# EAGLE design S3E_Cocoon (EAGLE 5.04)
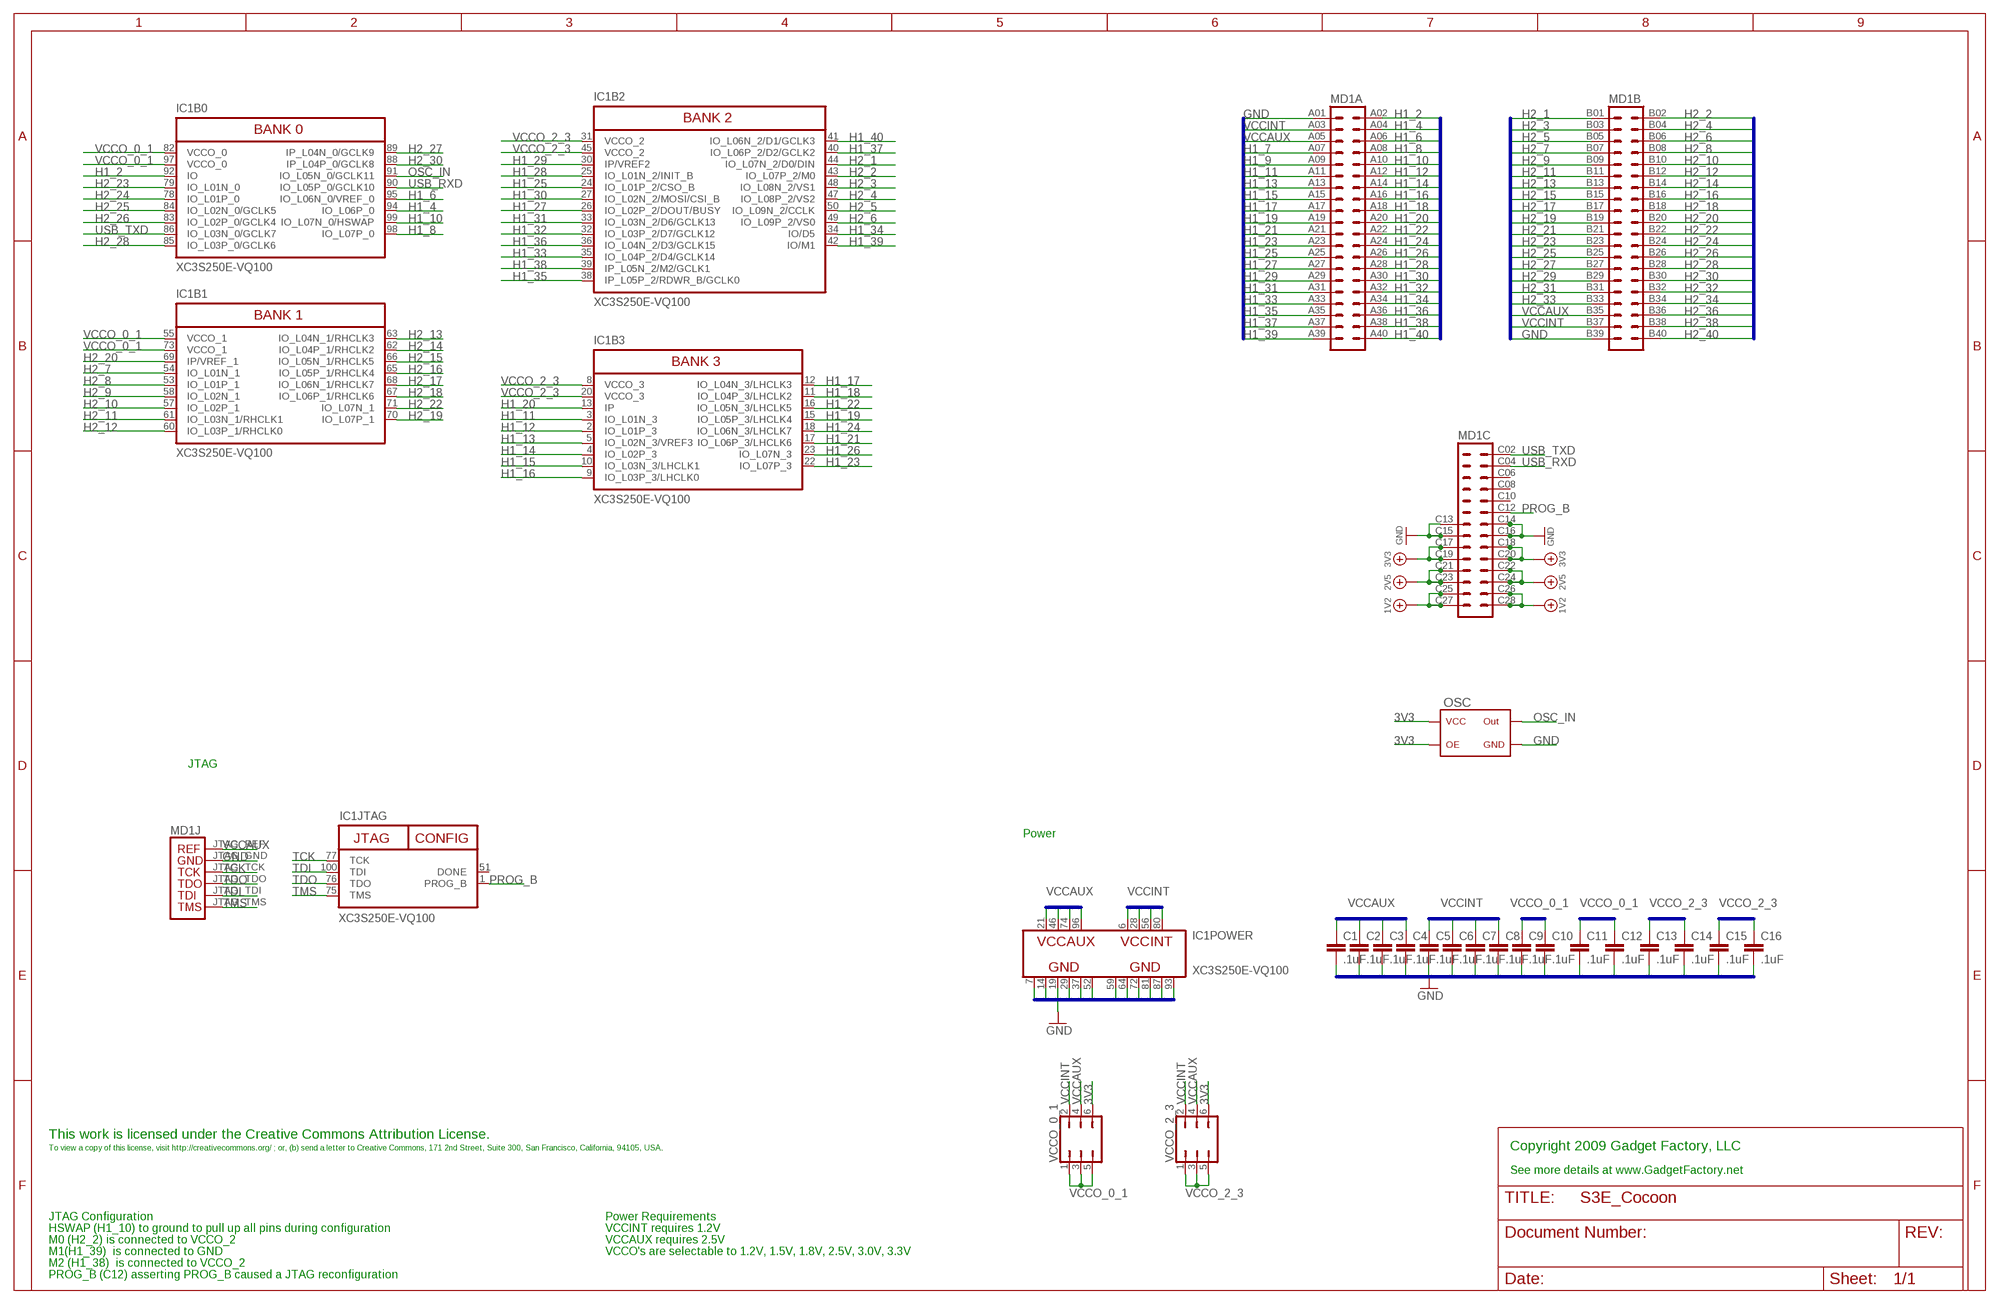
[diagram p0: schematic, sheet 1]

## Parts
C1  .1uF  C-EUC0402  [C0402]
C2  .1uF  C-EUC0402  [C0402]
C3  .1uF  C-EUC0402  [C0402]
C4  .1uF  C-EUC0402  [C0402]
C5  .1uF  C-EUC0402  [C0402]
C6  .1uF  C-EUC0402  [C0402]
C7  .1uF  C-EUC0402  [C0402]
C8  .1uF  C-EUC0402  [C0402]
C9  .1uF  C-EUC0402  [C0402]
C10  .1uF  C-EUC0402  [C0402]
C11  .1uF  C-EUC0402  [C0402]
C12  .1uF  C-EUC0402  [C0402]
C13  .1uF  C-EUC0402  [C0402]
C14  .1uF  C-EUC0402  [C0402]
C15  .1uF  C-EUC0402  [C0402]
C16  .1uF  C-EUC0402  [C0402]
IC1  XC3S250E-VQ100  [VQ100]
MD1  GADGETFACTORY_STACK  [GADGETFACTORY_STACK]
OSC  OSC1  [OSC1]
VCCO_0_1  JP3Q  [JP3Q]
VCCO_2_3  JP3Q  [JP3Q]

## Nets
3V3: MD1.C17(C:C17) MD1.C18(C:C18) MD1.C19(C:C19) MD1.C20(C:C20) OSC.1@1(OE) OSC.4@4(VCC) VCCO_0_1.6 VCCO_2_3.6
GND: C1.2 C2.2 C3.2 C4.2 C5.2 C6.2 C7.2 C8.2 C9.2 C10.2 C11.2 C12.2 C13.2 C14.2 C15.2 C16.2 IC1.7(POWER:GND) IC1.14(POWER:GND) IC1.19(POWER:GND) IC1.29(POWER:GND) IC1.37(POWER:GND) IC1.52(POWER:GND) IC1.59(POWER:GND) IC1.64(POWER:GND) IC1.72(POWER:GND) IC1.81(POWER:GND) IC1.87(POWER:GND) IC1.93(POWER:GND) MD1.A01(A:A01) MD1.B39(B:B39) MD1.C13(C:C13) MD1.C14(C:C14) MD1.C15(C:C15) MD1.C16(C:C16) MD1.JTAG_GND(J:JTAG_GND) OSC.2@2(GND)
H1_2: IC1.92(B0:IO) MD1.A02(A:A02)
H1_4: IC1.94(B0:IO_L06P_0) MD1.A04(A:A04)
H1_6: IC1.95(B0:IO_L06N_0/VREF_0) MD1.A06(A:A06)
H1_7: MD1.A07(A:A07)
H1_8: IC1.98(B0:IO_L07P_0) MD1.A08(A:A08)
H1_9: MD1.A09(A:A09)
H1_10: IC1.99(B0:IO_L07N_0/HSWAP) MD1.A10(A:A10)
H1_11: IC1.3(B3:IO_L01N_3) MD1.A11(A:A11)
H1_12: IC1.2(B3:IO_L01P_3) MD1.A12(A:A12)
H1_13: IC1.5(B3:IO_L02N_3/VREF3) MD1.A13(A:A13)
H1_14: IC1.4(B3:IO_L02P_3) MD1.A14(A:A14)
H1_15: IC1.10(B3:IO_L03N_3/LHCLK1) MD1.A15(A:A15)
H1_16: IC1.9(B3:IO_L03P_3/LHCLK0) MD1.A16(A:A16)
H1_17: IC1.12(B3:IO_L04N_3/LHCLK3) MD1.A17(A:A17)
H1_18: IC1.11(B3:IO_L04P_3/LHCLK2) MD1.A18(A:A18)
H1_19: IC1.15(B3:IO_L05P_3/LHCLK4) MD1.A19(A:A19)
H1_20: IC1.13(B3:IP) MD1.A20(A:A20)
H1_21: IC1.17(B3:IO_L06P_3/LHCLK6) MD1.A21(A:A21)
H1_22: IC1.16(B3:IO_L05N_3/LHCLK5) MD1.A22(A:A22)
H1_23: IC1.22(B3:IO_L07P_3) MD1.A23(A:A23)
H1_24: IC1.18(B3:IO_L06N_3/LHCLK7) MD1.A24(A:A24)
H1_25: IC1.24(B2:IO_L01P_2/CSO_B) MD1.A25(A:A25)
H1_26: IC1.23(B3:IO_L07N_3) MD1.A26(A:A26)
H1_27: IC1.26(B2:IO_L02P_2/DOUT/BUSY) MD1.A27(A:A27)
H1_28: IC1.25(B2:IO_L01N_2/INIT_B) MD1.A28(A:A28)
H1_29: IC1.30(B2:IP/VREF2) MD1.A29(A:A29)
H1_30: IC1.27(B2:IO_L02N_2/MOSI/CSI_B) MD1.A30(A:A30)
H1_31: IC1.33(B2:IO_L03N_2/D6/GCLK13) MD1.A31(A:A31)
H1_32: IC1.32(B2:IO_L03P_2/D7/GCLK12) MD1.A32(A:A32)
H1_33: IC1.35(B2:IO_L04P_2/D4/GCLK14) MD1.A33(A:A33)
H1_34: IC1.34(B2:IO/D5) MD1.A34(A:A34)
H1_35: IC1.38(B2:IP_L05P_2/RDWR_B/GCLK0) MD1.A35(A:A35)
H1_36: IC1.36(B2:IO_L04N_2/D3/GCLK15) MD1.A36(A:A36)
H1_37: IC1.40(B2:IO_L06P_2/D2/GCLK2) MD1.A37(A:A37)
H1_38: IC1.39(B2:IP_L05N_2/M2/GCLK1) MD1.A38(A:A38)
H1_39: IC1.42(B2:IO/M1) MD1.A39(A:A39)
H1_40: IC1.41(B2:IO_L06N_2/D1/GCLK3) MD1.A40(A:A40)
H2_1: IC1.44(B2:IO_L07N_2/D0/DIN) MD1.B01(B:B01)
H2_2: IC1.43(B2:IO_L07P_2/M0) MD1.B02(B:B02)
H2_3: IC1.48(B2:IO_L08N_2/VS1) MD1.B03(B:B03)
H2_4: IC1.47(B2:IO_L08P_2/VS2) MD1.B04(B:B04)
H2_5: IC1.50(B2:IO_L09N_2/CCLK) MD1.B05(B:B05)
H2_6: IC1.49(B2:IO_L09P_2/VS0) MD1.B06(B:B06)
H2_7: IC1.54(B1:IO_L01N_1) MD1.B07(B:B07)
H2_8: IC1.53(B1:IO_L01P_1) MD1.B08(B:B08)
H2_9: IC1.58(B1:IO_L02N_1) MD1.B09(B:B09)
H2_10: IC1.57(B1:IO_L02P_1) MD1.B10(B:B10)
H2_11: IC1.61(B1:IO_L03N_1/RHCLK1) MD1.B11(B:B11)
H2_12: IC1.60(B1:IO_L03P_1/RHCLK0) MD1.B12(B:B12)
H2_13: IC1.63(B1:IO_L04N_1/RHCLK3) MD1.B13(B:B13)
H2_14: IC1.62(B1:IO_L04P_1/RHCLK2) MD1.B14(B:B14)
H2_15: IC1.66(B1:IO_L05N_1/RHCLK5) MD1.B15(B:B15)
H2_16: IC1.65(B1:IO_L05P_1/RHCLK4) MD1.B16(B:B16)
H2_17: IC1.68(B1:IO_L06N_1/RHCLK7) MD1.B17(B:B17)
H2_18: IC1.67(B1:IO_L06P_1/RHCLK6) MD1.B18(B:B18)
H2_19: IC1.70(B1:IO_L07P_1) MD1.B19(B:B19)
H2_20: IC1.69(B1:IP/VREF_1) MD1.B20(B:B20)
H2_21: MD1.B21(B:B21)
H2_22: IC1.71(B1:IO_L07N_1) MD1.B22(B:B22)
H2_23: IC1.79(B0:IO_L01N_0) MD1.B23(B:B23)
H2_24: IC1.78(B0:IO_L01P_0) MD1.B24(B:B24)
H2_25: IC1.84(B0:IO_L02N_0/GCLK5) MD1.B25(B:B25)
H2_26: IC1.83(B0:IO_L02P_0/GCLK4) MD1.B26(B:B26)
H2_27: IC1.89(B0:IP_L04N_0/GCLK9) MD1.B27(B:B27)
H2_28: IC1.85(B0:IO_L03P_0/GCLK6) MD1.B28(B:B28)
H2_29: MD1.B29(B:B29)
H2_30: IC1.88(B0:IP_L04P_0/GCLK8) MD1.B30(B:B30)
H2_31: MD1.B31(B:B31)
H2_32: MD1.B32(B:B32)
H2_33: MD1.B33(B:B33)
H2_34: MD1.B34(B:B34)
H2_36: MD1.B36(B:B36)
H2_38: MD1.B38(B:B38)
H2_40: MD1.B40(B:B40)
OSC_IN: IC1.91(B0:IO_L05N_0/GCLK11) OSC.3@3(OUT)
PROG_B: IC1.1(JTAG:PROG_B) MD1.C12(C:C12)
TCK: IC1.77(JTAG:TCK) MD1.JTAG_TCK(J:JTAG_TCK)
TDI: IC1.100(JTAG:TDI) MD1.JTAG_TDI(J:JTAG_TDI)
TDO: IC1.76(JTAG:TDO) MD1.JTAG_TDO(J:JTAG_TDO)
TMS: IC1.75(JTAG:TMS) MD1.JTAG_TMS(J:JTAG_TMS)
USB_RXD: IC1.90(B0:IO_L05P_0/GCLK10) MD1.C04(C:C04)
USB_TXD: IC1.86(B0:IO_L03N_0/GCLK7) MD1.C02(C:C02)
VCCAUX: C1.1 C2.1 C3.1 C4.1 IC1.21(POWER:VCCAUX) IC1.46(POWER:VCCAUX) IC1.74(POWER:VCCAUX) IC1.96(POWER:VCCAUX) MD1.A05(A:A05) MD1.B35(B:B35) MD1.C21(C:C21) MD1.C22(C:C22) MD1.C23(C:C23) MD1.C24(C:C24) MD1.JTAG_REF(J:JTAG_REF) VCCO_0_1.4 VCCO_2_3.4 ; supply symbol labelled 2V5
VCCINT: C5.1 C6.1 C7.1 C8.1 IC1.6(POWER:VCCINT) IC1.28(POWER:VCCINT) IC1.56(POWER:VCCINT) IC1.80(POWER:VCCINT) MD1.A03(A:A03) MD1.B37(B:B37) MD1.C25(C:C25) MD1.C26(C:C26) MD1.C27(C:C27) MD1.C28(C:C28) VCCO_0_1.2 VCCO_2_3.2 ; supply symbol labelled 1V2
VCCO_0_1: C9.1 C10.1 C11.1 C12.1 IC1.55(B1:VCCO_1) IC1.73(B1:VCCO_1) IC1.82(B0:VCCO_0) IC1.97(B0:VCCO_0) VCCO_0_1.1 VCCO_0_1.3 VCCO_0_1.5
VCCO_2_3: C13.1 C14.1 C15.1 C16.1 IC1.8(B3:VCCO_3) IC1.20(B3:VCCO_3) IC1.31(B2:VCCO_2) IC1.45(B2:VCCO_2) VCCO_2_3.1 VCCO_2_3.3 VCCO_2_3.5
Unconnected: IC1.51(JTAG:DONE) MD1.C06(C:C06) MD1.C08(C:C08) MD1.C10(C:C10)

## Buses
H1_[1..40]
GND
VCCAUX
VCCINT
H2_[1..40]
VCCO_0_1
VCCO_2_3

## Notes on the sheet
- JTAG
- Power
- This work is licensed under the Creative Commons Attribution License.
- To view a copy of this license, visit http://creativecommons.org/ ; or, (b) send a letter to Creative Commons, 171 2nd Street, Suite 300, San Francisco, California, 94105, USA. | Copyright 2009 Gadget Factory, LLC
- See more details at www.GadgetFactory.net
- JTAG Configuration | Power Requirements
- HSWAP (H1_10) to ground to pull up all pins during configuration | VCCINT requires 1.2V
- M0 (H2_2) is connected to VCCO_2 | VCCAUX requires 2.5V
- M1(H1_39)  is connected to GND | VCCO's are selectable to 1.2V, 1.5V, 1.8V, 2.5V, 3.0V, 3.3V
- M2 (H1_38)  is connected to VCCO_2
- PROG_B (C12) asserting PROG_B caused a JTAG reconfiguration

## Library data of the parts
C1-C16 = rcl:C-EU: CAPACITOR, European symbol
IC1 = xilinx-xc3sxxxe_vq100:XC3S250E: Xilinx Spartan 3E FPGA
MD1 = GadgetFactory:GADGETFACTORY_STACK
OSC = MondoCPLDCore-XC95_Rev1.5:OSC1
VCCO_0_1 VCCO_2_3 = GadgetFactory:JP3Q: JUMPER

## Board
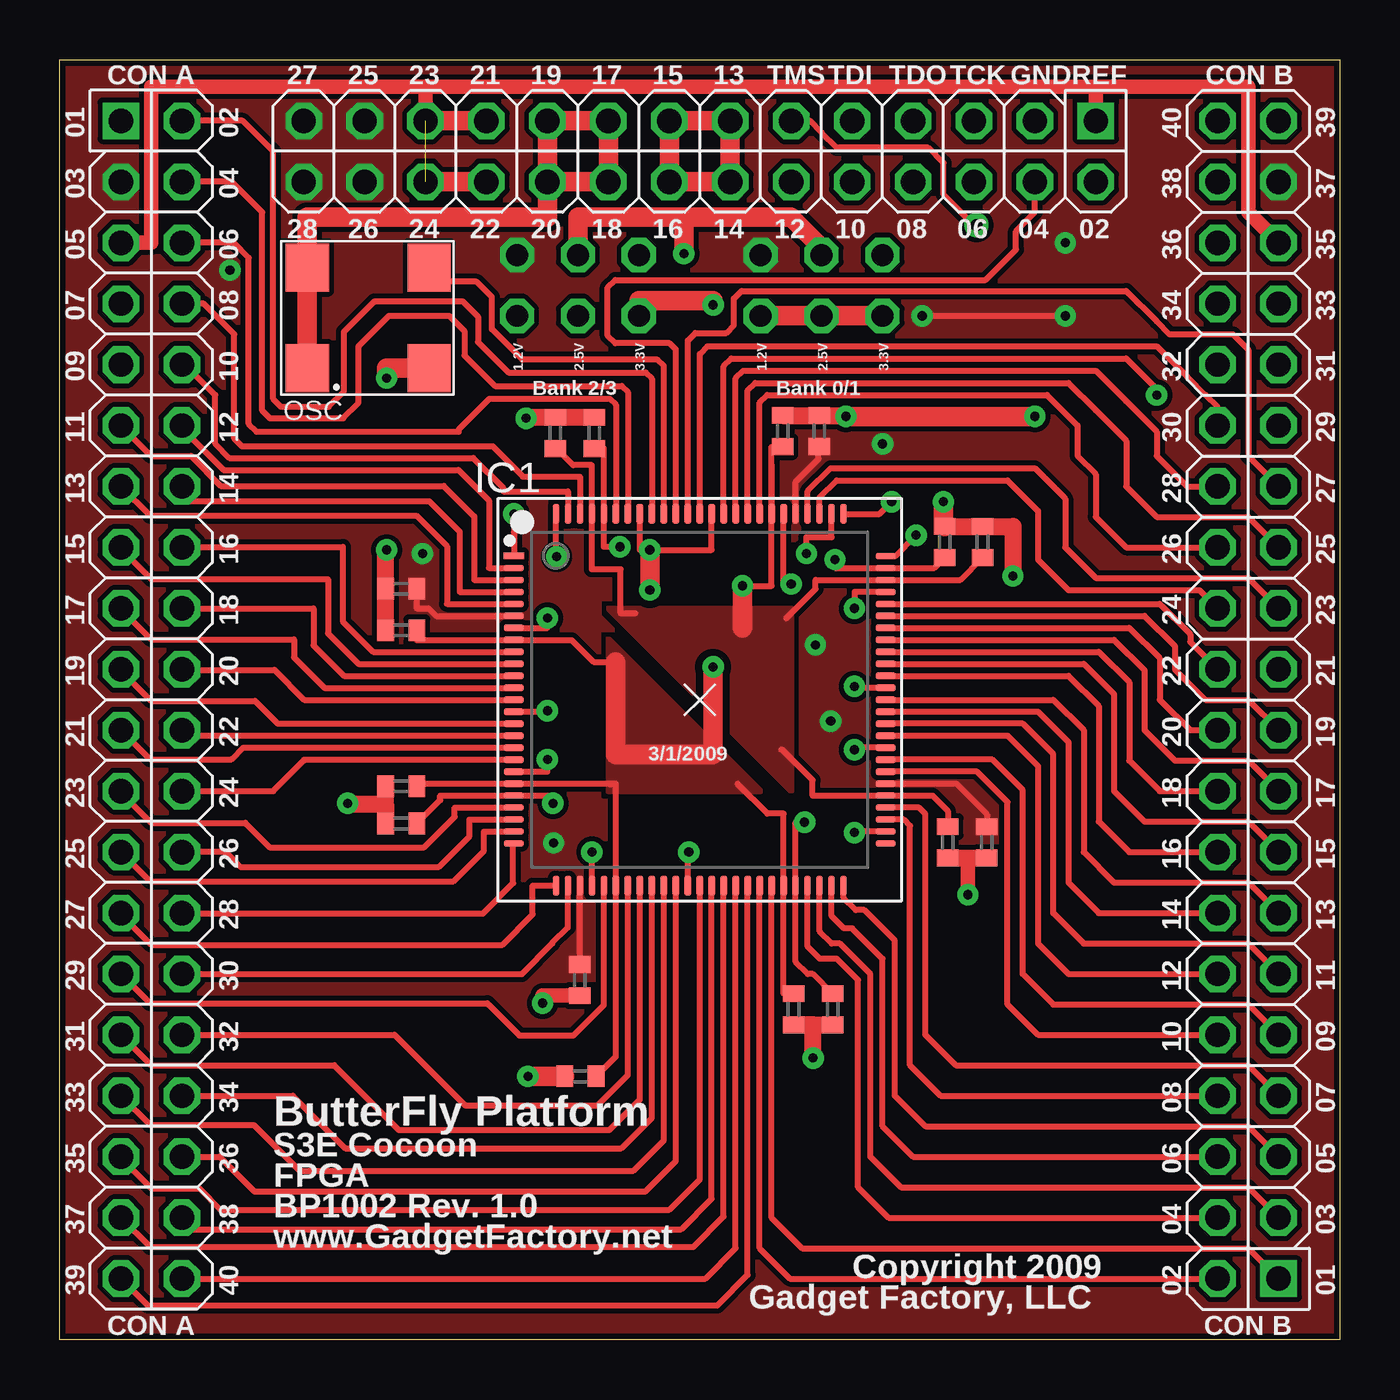
[diagram p1: board, top side]
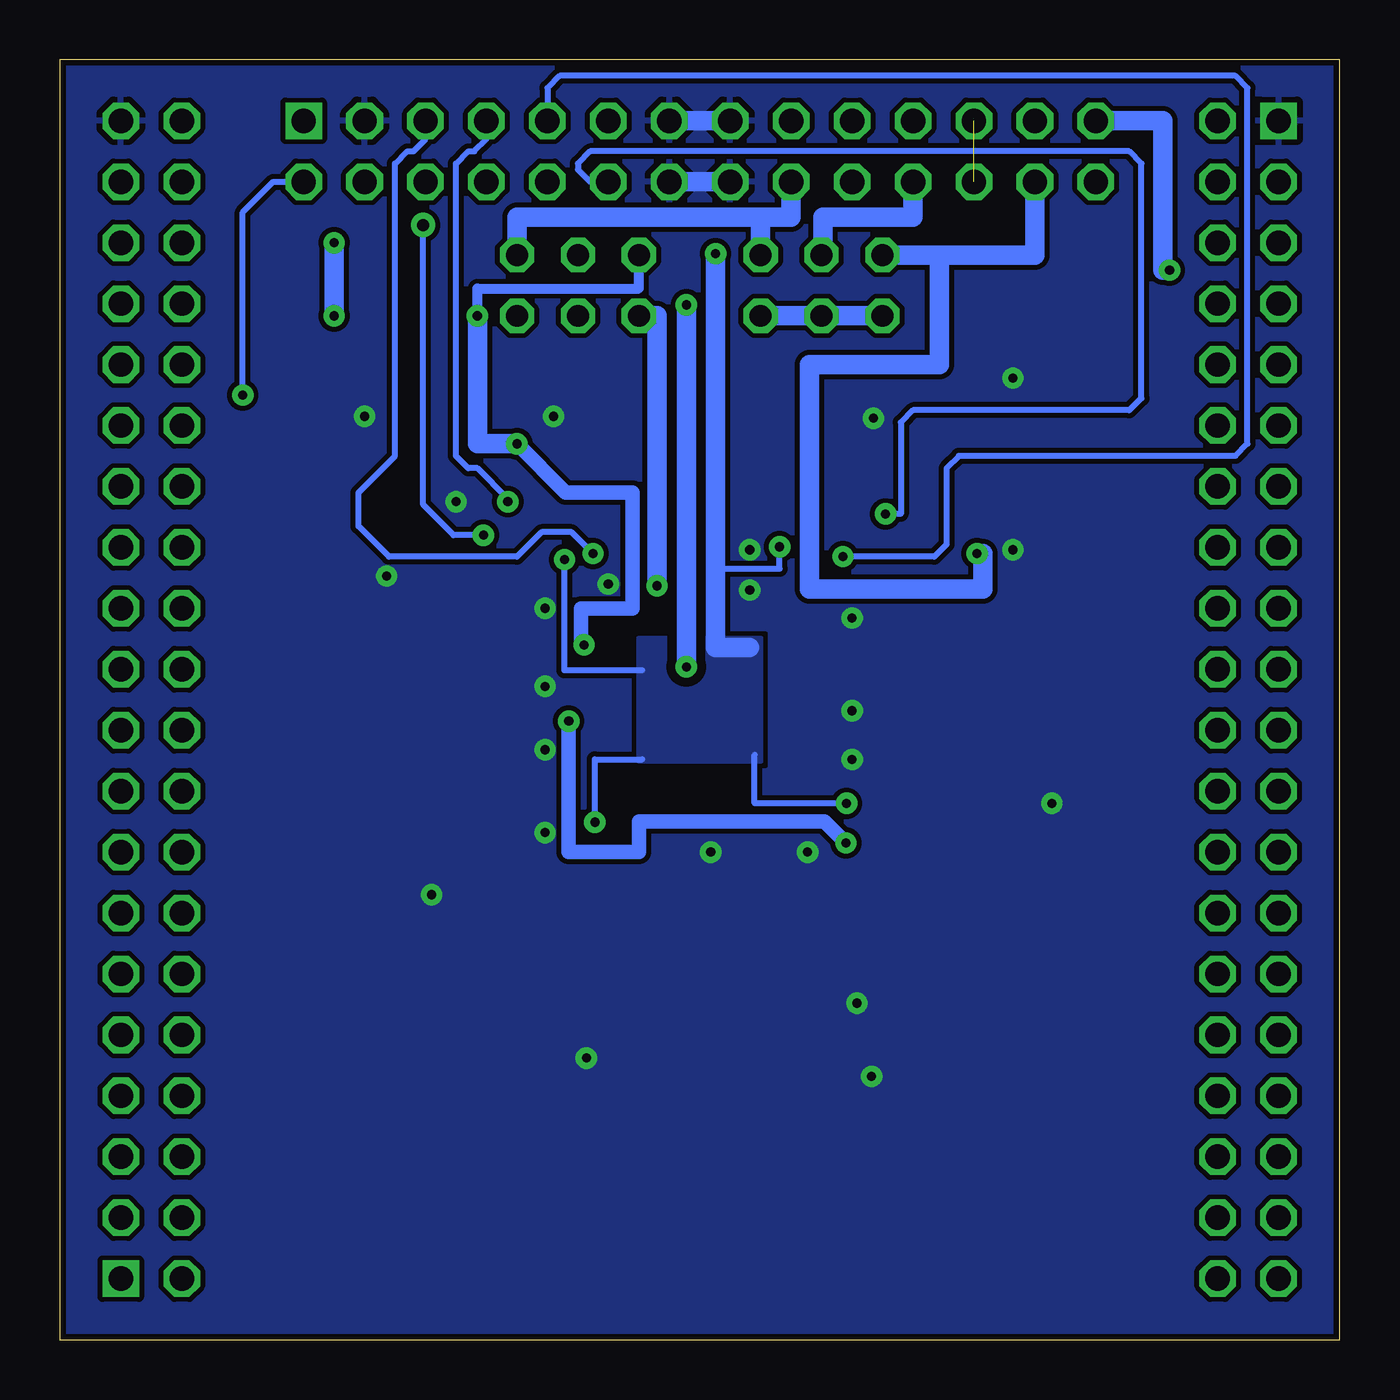
[diagram p2: board, bottom side, seen from below]

Size 53.34 x 53.34 mm. Coordinates in mm from the lower left corner, seen from the top.
Copper layers (1*16): Top 0.035mm / dielectric 1.5mm / Bottom 0.035mm
Design rules "SparkFun *": minimum track width 8mil, minimum drill 15mil, track to track 8mil, track to pad 8mil, pad to pad 8mil, via to via 8mil, smd to smd 8mil, copper to edge 10mil, drill to drill 8mil, minimum pad ring 10mil, minimum via ring 10mil, stop-mask expansion 4mil, vias tented up to drill 25mil, thermal gap 10mil

### Footprints (pad centres in the part's own frame; a part is rotated, then mirrored left to right if it is on the bottom)
C0402 = smd 0.7 x 0.9: 1 -0.65,0; 2 0.65,0
VQ100 = smd 0.85 x 0.28: 1 -7.75,6; 2 -7.75,5.5; 3 -7.75,5; 4 -7.75,4.5; 5 -7.75,4; 6 -7.75,3.5; 7 -7.75,3; 8 -7.75,2.5; 9 -7.75,2; 10 -7.75,1.5; 11 -7.75,1; 12 -7.75,0.5; 13 -7.75,0; 14 -7.75,-0.5; 15 -7.75,-1; 16 -7.75,-1.5; 17 -7.75,-2; 18 -7.75,-2.5; 19 -7.75,-3; 20 -7.75,-3.5; 21 -7.75,-4; 22 -7.75,-4.5; 23 -7.75,-5; 24 -7.75,-5.5; 25 -7.75,-6; 51 7.75,-6; 52 7.75,-5.5; 53 7.75,-5; 54 7.75,-4.5; 55 7.75,-4; 56 7.75,-3.5; 57 7.75,-3; 58 7.75,-2.5; 59 7.75,-2; 60 7.75,-1.5; 61 7.75,-1; 62 7.75,-0.5; 63 7.75,0; 64 7.75,0.5; 65 7.75,1; 66 7.75,1.5; 67 7.75,2; 68 7.75,2.5; 69 7.75,3; 70 7.75,3.5; 71 7.75,4; 72 7.75,4.5; 73 7.75,5; 74 7.75,5.5; 75 7.75,6 | smd 0.28 x 0.85: 26 -6,-7.75; 27 -5.5,-7.75; 28 -5,-7.75; 29 -4.5,-7.75; 30 -4,-7.75; 31 -3.5,-7.75; 32 -3,-7.75; 33 -2.5,-7.75; 34 -2,-7.75; 35 -1.5,-7.75; 36 -1,-7.75; 37 -0.5,-7.75; 38 0,-7.75; 39 0.5,-7.75; 40 1,-7.75; 41 1.5,-7.75; 42 2,-7.75; 43 2.5,-7.75; 44 3,-7.75; 45 3.5,-7.75; 46 4,-7.75; 47 4.5,-7.75; 48 5,-7.75; 49 5.5,-7.75; 50 6,-7.75; 76 6,7.75; 77 5.5,7.75; 78 5,7.75; 79 4.5,7.75; 80 4,7.75; 81 3.5,7.75; 82 3,7.75; 83 2.5,7.75; 84 2,7.75; 85 1.5,7.75; 86 1,7.75; 87 0.5,7.75; 88 0,7.75; 89 -0.5,7.75; 90 -1,7.75; 91 -1.5,7.75; 92 -2,7.75; 93 -2.5,7.75; 94 -3,7.75; 95 -3.5,7.75; 96 -4,7.75; 97 -4.5,7.75; 98 -5,7.75; 99 -5.5,7.75; 100 -6,7.75
GADGETFACTORY_STACK = drill 1.016 square: A01 2.54,50.8; B01 50.8,2.54; JTAG_REF 43.18,50.8 | drill 1.016 octagon: A02 5.08,50.8; A03 2.54,48.26; A04 5.08,48.26; A05 2.54,45.72; A06 5.08,45.72; A07 2.54,43.18; A08 5.08,43.18; A09 2.54,40.64; A10 5.08,40.64; A11 2.54,38.1; A12 5.08,38.1; A13 2.54,35.56; A14 5.08,35.56; A15 2.54,33.02; A16 5.08,33.02; A17 2.54,30.48; A18 5.08,30.48; A19 2.54,27.94; A20 5.08,27.94; A21 2.54,25.4; A22 5.08,25.4; A23 2.54,22.86; A24 5.08,22.86; A25 2.54,20.32; A26 5.08,20.32; A27 2.54,17.78; A28 5.08,17.78; A29 2.54,15.24; A30 5.08,15.24; A31 2.54,12.7; A32 5.08,12.7; A33 2.54,10.16; A34 5.08,10.16; A35 2.54,7.62; A36 5.08,7.62; A37 2.54,5.08; A38 5.08,5.08; A39 2.54,2.54; A40 5.08,2.54; B02 48.26,2.54; B03 50.8,5.08; B04 48.26,5.08; B05 50.8,7.62; B06 48.26,7.62; B07 50.8,10.16; B08 48.26,10.16; B09 50.8,12.7; B10 48.26,12.7; B11 50.8,15.24; B12 48.26,15.24; B13 50.8,17.78; B14 48.26,17.78; B15 50.8,20.32; B16 48.26,20.32; B17 50.8,22.86; B18 48.26,22.86; B19 50.8,25.4; B20 48.26,25.4; B21 50.8,27.94; B22 48.26,27.94; B23 50.8,30.48; B24 48.26,30.48; B25 50.8,33.02; B26 48.26,33.02; B27 50.8,35.56; B28 48.26,35.56; B29 50.8,38.1; B30 48.26,38.1; B31 50.8,40.64; B32 48.26,40.64; B33 50.8,43.18; B34 48.26,43.18; B35 50.8,45.72; B36 48.26,45.72; B37 50.8,48.26; B38 48.26,48.26; B39 50.8,50.8; B40 48.26,50.8; C02 43.18,48.26; C04 40.64,48.26; C06 38.1,48.26; C08 35.56,48.26; C10 33.02,48.26; C12 30.48,48.26; C13 27.94,50.8; C14 27.94,48.26; C15 25.4,50.8; C16 25.4,48.26; C17 22.86,50.8; C18 22.86,48.26; C19 20.32,50.8; C20 20.32,48.26; C21 17.78,50.8; C22 17.78,48.26; C23 15.24,50.8; C24 15.24,48.26; C25 12.7,50.8; C26 12.7,48.26; C27 10.16,50.8; C28 10.16,48.26; JTAG_GND 40.64,50.8; JTAG_TCK 38.1,50.8; JTAG_TDI 33.02,50.8; JTAG_TDO 35.56,50.8; JTAG_TMS 30.48,50.8
OSC1 = smd 1.8 x 2: 1@1 0,0; 2@2 5.08,0; 3@3 5.08,4.2; 4@4 0,4.2
JP3Q = drill 0.914 octagon: 1 -2.54,-1.27; 2 -2.54,1.27; 3 0,-1.27; 4 0,1.27; 5 2.54,-1.27; 6 2.54,1.27

### Placement (x,y rotation side)
C1  14.22,21.51 180 top
C2  32.21,13.77 270 top
C3  36.88,33.25 90 top
C4  22.28,37.8 90 top
C5  14.22,31.29 180 top
C6  21.67,14.99 270 top
C7  38.63,20.73 270 top
C8  31.65,37.87 90 top
C9  30.12,37.87 90 top
C10  20.65,37.8 90 top
C11  37.01,20.73 270 top
C12  38.46,33.25 90 top
C13  21.69,10.97 180 top
C14  30.58,13.77 270 top
C15  14.22,29.57 180 top
C16  14.22,23.06 180 top
IC1  26.67,26.67 0 top
MD1  0,0 0 top
OSC  10.31,40.49 0 top
VCCO_0_1  31.75,43.94 0 top
VCCO_2_3  21.59,43.94 0 top

### Tracks (layer width: path | path; a pad name or v marks a point on that pad's centre or on a via)
3V3
  Top 0.813: OSC.1@1 OSC.4@4 10.31,46.79 20.32,46.79 MD1.C20 | MD1.C20 MD1.C18 MD1.C17 MD1.C19 MD1.C20
  Bottom 0.813: MD1.C18 22.86,46.79 24.18,46.79 | VCCO_2_3.6 24.13,46.79 24.18,46.79 | VCCO_0_1.6 34.29,46.79 24.18,46.79
GND  (via drill 0.38, 0.38 pad 0.61)
  Top 0.254: IC1.29 v22.17,20.32 22.15,20.32 | IC1.37 26.17,20.32 v26.21,20.32 | IC1.52 33.12,21.17 v33.12,21.13 | IC1.59 33.12,24.67 v33.12,24.59 | IC1.64 33.12,27.17 v33.12,27.23 | IC1.72 33.12,31.17 v33.12,30.48 | IC1.93 24.17,32.92 v24.59,32.92 27.17,32.92 IC1.87 | IC1.7 20.32,29.67 v20.32,30.07 | IC1.14 20.32,26.17 v20.32,26.21 | IC1.19 20.32,23.67 v20.32,24.18 | IC1.81 30.17,31.5 v30.48,31.5
  Top 0.61: C6.2 20.12,14.34 v20.12,14.02 | C11.2 37.85,20.08 v37.85,18.54
  Top 0.711: C15.2 C5.2 13.57,32.92 v13.61,32.92 | 13.57,22.33 C1.2 | 13.57,22.33 C16.2 | C4.2 C10.2 19.43,38.45 v19.43,38.41 | C8.2 C9.2 32.77,38.52 v32.77,38.48 | C3.2 C12.2 39.73,33.9 v39.73,31.83 | C11.2 C7.2 | 31.39,13.12 C14.2 | 31.39,13.12 C2.2 | 13.57,22.33 11.99,22.33 v11.99,22.35 | 31.39,13.12 v31.39,11.73
  Top 0.813: OSC.2@2 13.61,40.49 v13.61,40.08 | v19.51,10.97 C13.2 | v32.77,38.48 v40.64,38.48 | v24.59,31.24 v24.59,32.92 | v36.83,34.92 36.83,33.95 C3.2 | MD1.C16 MD1.C15 MD1.C13 MD1.C14 MD1.C16
  Bottom 0.813: MD1.C15 MD1.C13 | MD1.C16 MD1.C14
  pour Bottom (isolate 0.203, rank 3): 0,53.34 53.34,53.34 53.34,0 0,0
H1_2
  Top 0.254: MD1.A02 7.62,50.8 8.89,49.53 8.89,39.2 9.21,38.89 11.2,38.89 11.84,39.52 11.84,42.01 13.11,43.28 16.79,43.28 17.42,42.65 17.42,41.58 18.69,40.31 24.42,40.31 24.67,40.06 IC1.92
H1_4
  Top 0.254: MD1.A04 7.16,48.26 8.43,46.99 8.43,38.72 8.75,38.41 11.81,38.41 12.45,39.04 12.45,41.4 13.72,42.67 16.23,42.67 16.87,42.04 16.87,41.02 18.14,39.75 23.42,39.75 23.67,39.5 IC1.94
H1_6
  Top 0.254: IC1.95 23.17,38.96 22.92,39.22 17.91,39.22 16.64,37.95 16.64,37.85 8.19,37.85 7.87,38.16 7.87,45.09 7.24,45.72 MD1.A06
H1_8
  Top 0.254: IC1.98 21.67,35.97 19.3,35.97 18.03,37.24 7.58,37.24 7.26,37.55 7.26,41.91 5.99,43.18 MD1.A08
H1_10
  Top 0.254: IC1.99 21.17,35.36 18.49,35.36 18.49,35.48 17.22,36.75 7.06,36.75 6.48,37.34 6.48,39.37 5.21,40.64 MD1.A10
H1_11
  Top 0.254: IC1.3 17.27,31.67 17.27,34.31 16,35.59 6.71,35.59 5.46,36.83 3.81,36.83 MD1.A11
H1_12
  Top 0.254: IC1.2 17.88,32.17 17.88,34.98 16.61,36.25 6.81,36.25 6.81,36.27 5.08,38 MD1.A12
H1_13
  Top 0.254: IC1.5 16.13,30.67 16.13,33.07 14.86,34.34 3.76,34.34 MD1.A13
H1_14
  Top 0.254: IC1.4 16.66,31.17 16.66,33.68 15.39,34.95 5.08,34.95 MD1.A14
H1_15
  Top 0.254: IC1.10 12.45,28.17 11.18,29.44 11.18,31.7 3.81,31.7 2.54,32.97 MD1.A15
H1_16
  Top 0.254: IC1.9 13.06,28.67 11.79,29.94 11.79,33.05 5.08,33.05 MD1.A16
H1_17
  Top 0.254: IC1.12 11.02,27.17 9.75,28.44 9.75,29.18 3.81,29.18 2.54,30.45 MD1.A17
H1_18
  Top 0.254: IC1.11 11.84,27.67 10.57,28.94 10.57,30.48 MD1.A18
H1_19
  Top 0.254: IC1.15 9.08,25.67 8.13,26.62 3.81,26.62 2.54,27.89 MD1.A19
H1_20
  Top 0.254: IC1.13 10.19,26.67 8.94,27.91 5.08,27.91 MD1.A20
H1_21
  Top 0.254: IC1.17 7.64,24.67 7.16,24.18 3.76,24.18 MD1.A21
H1_22
  Top 0.254: IC1.16 5.08,25.17 MD1.A22
H1_23
  Top 0.254: IC1.22 16.46,22.17 16.46,21.79 15.19,20.52 8.74,20.52 7.72,21.54 3.81,21.54 2.54,22.81 MD1.A23
H1_24
  Top 0.254: IC1.18 10.16,24.17 10.16,24.13 8.89,22.86 MD1.A24
H1_25
  Top 0.254: IC1.24 17.68,21.17 17.68,20.37 16.41,19.1 3.76,19.1 MD1.A25
H1_26
  Top 0.254: IC1.23 17.07,21.67 17.07,20.98 15.8,19.71 7.52,19.71 6.91,20.32 MD1.A26
H1_27
  Top 0.254: IC1.26 19.71,18.92 19.71,17.73 18.44,16.46 3.81,16.46 2.54,17.73 MD1.A27
H1_28
  Top 0.254: IC1.25 18.9,20.67 18.9,19.02 17.63,17.75 5.08,17.75 MD1.A28
H1_29
  Top 0.254: IC1.30 22.67,13.95 21.4,12.68 19.15,12.68 17.88,13.95 17.8,14.02 3.76,14.02 MD1.A29
H1_30
  Top 0.254: IC1.27 21.17,17.17 20.52,16.52 20.52,16.51 19.25,15.24 MD1.A30
H1_31
  Top 0.254: IC1.33 24.17,10.01 22.9,8.74 14.12,8.74 11.43,11.43 3.81,11.43 MD1.A31
H1_32
  Top 0.254: MD1.A32 13.95,12.7 16.48,10.16 16.89,9.75 22.4,9.75 23.67,11.02 IC1.32
H1_33
  Top 0.254: MD1.A33 3.76,8.94 8.08,8.94 9.35,7.67 9.98,7.04 23.9,7.04 25.17,8.31 IC1.35
H1_34
  Top 0.254: MD1.A34 9.7,10.16 10.97,8.89 11.89,7.98 23.4,7.98 24.67,9.25 IC1.34
H1_35
  Top 0.254: MD1.A35 2.54,7.57 3.81,6.3 5.82,6.3 6.71,5.41 25.4,5.41 26.67,6.68 IC1.38
H1_36
  Top 0.254: MD1.A36 6.66,7.62 7.92,6.35 8.1,6.17 24.4,6.17 25.67,7.44 IC1.36
H1_37
  Top 0.254: MD1.A37 3.76,3.86 26.4,3.86 27.67,5.13 IC1.40
H1_38
  Top 0.254: IC1.39 27.17,5.87 25.9,4.6 5.56,4.6 MD1.A38
H1_39
  Top 0.254: MD1.A39 3.66,1.42 27.4,1.42 28.67,2.69 IC1.42
H1_40
  Top 0.254: MD1.A40 26.9,2.54 28.17,3.81 IC1.41
H2_1
  Top 0.254: IC1.44 29.67,5.08 30.94,3.81 49.53,3.81 MD1.B01
H2_2
  Top 0.254: IC1.43 29.17,3.81 30.44,2.54 MD1.B02
H2_3
  Top 0.254: IC1.48 31.67,17.02 32.18,16.51 32.51,16.51 33.78,15.24 33.78,7.62 35.05,6.35 49.53,6.35 MD1.B03
H2_4
  Top 0.254: IC1.47 31.17,16.38 31.68,15.88 32.38,15.88 33.27,14.99 33.27,6.35 34.54,5.08 MD1.B04
H2_5
  Top 0.254: IC1.50 32.67,18.41 33.18,17.91 33.53,17.91 34.8,16.64 34.8,10.16 36.07,8.89 49.53,8.89 MD1.B05
H2_6
  Top 0.254: IC1.49 32.17,17.65 32.68,17.14 33.02,17.14 34.29,15.88 34.29,8.89 35.56,7.62 MD1.B06
H2_7
  Top 0.254: IC1.54 35.81,22.17 36.07,21.92 36.07,12.7 37.34,11.43 49.53,11.43 MD1.B07
H2_8
  Top 0.254: IC1.53 35.18,21.67 35.43,21.42 35.43,11.43 36.7,10.16 MD1.B08
H2_9
  Top 0.254: IC1.58 38.86,24.17 40.13,22.9 40.13,15.24 41.4,13.97 49.53,13.97 MD1.B09
H2_10
  Top 0.254: IC1.57 38.23,23.67 39.5,22.4 39.5,13.97 40.77,12.7 MD1.B10
H2_11
  Top 0.254: IC1.61 40.13,25.67 41.4,24.4 41.4,17.78 42.67,16.51 49.53,16.51 MD1.B11
H2_12
  Top 0.254: IC1.60 39.5,25.17 40.77,23.9 40.77,16.51 42.04,15.24 MD1.B12
H2_13
  Top 0.254: IC1.63 41.4,26.67 42.67,25.4 42.67,20.32 43.94,19.05 49.53,19.05 MD1.B13
H2_14
  Top 0.254: IC1.62 40.77,26.17 42.04,24.9 42.04,19.05 43.31,17.78 MD1.B14
H2_15
  Top 0.254: IC1.66 42.67,28.17 43.94,26.9 43.94,22.86 45.21,21.59 49.53,21.59 MD1.B15
H2_16
  Top 0.254: IC1.65 42.04,27.67 43.31,26.4 43.31,21.59 44.58,20.32 MD1.B16
H2_17
  Top 0.254: IC1.68 43.94,29.17 45.21,27.9 45.21,25.4 46.48,24.13 49.53,24.13 MD1.B17
H2_18
  Top 0.254: IC1.67 43.31,28.67 44.58,27.4 44.58,24.13 45.85,22.86 MD1.B18
H2_19
  Top 0.254: IC1.70 45.21,30.17 46.48,28.9 46.48,27.94 47.75,26.67 49.53,26.67 MD1.B19
H2_20
  Top 0.254: IC1.69 44.58,29.67 45.85,28.4 45.85,26.67 47.12,25.4 MD1.B20
H2_22
  Top 0.254: IC1.71 45.85,30.67 47.12,29.4 47.12,29.08 MD1.B22
H2_23
  Top 0.254: IC1.79 31.17,35.36 32.13,36.32 40.64,36.32 41.91,35.05 41.91,33.02 43.18,31.75 49.53,31.75 MD1.B23
H2_24
  Top 0.254: IC1.78 31.67,35.1 32.38,35.81 39.5,35.81 40.77,34.54 40.77,32.51 42.04,31.24 47.5,31.24 MD1.B24
H2_25
  Top 0.254: IC1.84 28.67,39.56 28.99,39.88 42.04,39.88 43.18,38.73 44.45,37.47 44.45,35.56 45.72,34.29 49.53,34.29 MD1.B25
H2_26
  Top 0.254: IC1.83 29.17,39.05 29.49,39.37 41.15,39.37 42.42,38.1 42.42,36.83 43.18,36.07 43.18,34.29 44.45,33.02 MD1.B26
H2_27
  Top 0.254: IC1.89 26.17,41.64 26.49,41.96 27.77,41.96 28.09,42.28 28.09,43.4 28.41,43.71 44.45,43.71 45.72,42.44 46.25,41.91 48.9,41.91 49.53,41.27 49.53,36.83 MD1.B27
H2_28
  Top 0.254: IC1.85 28.17,40.07 28.49,40.39 43.18,40.39 44.45,39.12 45.47,38.1 45.72,37.85 45.72,36.83 46.99,35.56 MD1.B28
H2_30
  Top 0.254: 26.67,34.29 IC1.88 26.67,41.08 26.99,41.4 45.72,41.4 46.99,40.13 47.75,39.37 48.26,38.86 MD1.B30
OSC_IN
  Top 0.254: OSC.3@3 15.39,44.09 17.37,44.09 18.01,43.46 18.01,42.11 19.28,40.84 24.92,40.84 25.17,40.59 IC1.91
PROG_B  (via drill 0.38)
  Top 0.254: IC1.1 18.92,33.66 v18.92,34.42
  Bottom 0.254: MD1.C12 31.24,48.26 31.75,48.77 31.75,49.02 31.24,49.53 8.76,49.53 8.26,49.02 8.26,39.24 8.76,38.73 17.78,38.73 18.29,38.23 18.29,34.42 v18.92,34.42
TCK  (via drill 0.38)
  Top 0.254: v31.11,32.77 31.11,33.45 32.17,33.45 IC1.77
  Bottom 0.254: MD1.JTAG_TCK 38.1,50.04 38.61,49.53 38.86,49.53 39.37,49.02 39.37,36.83 40.64,35.56 40.89,35.31 40.89,33.91 39.62,32.64 34.29,32.64 33.27,33.66 32,33.66 v31.11,32.77
TDI  (via drill 0.38)
  Top 0.254: IC1.100 20.67,32.64 v20.7,32.64
  Bottom 0.254: v20.7,32.64 16.89,32.64 16.38,33.15 16.38,36.32 15.88,36.83 4.34,36.83 3.83,37.34 3.83,52.17 4.34,52.68 32.51,52.68 33.02,52.17 MD1.JTAG_TDI
TDO  (via drill 0.38)
  Top 0.254: IC1.76 34.17,34.42 v34.67,34.92
  Bottom 0.254: v34.67,34.92 34.67,35.05 35.94,36.32 36.32,36.32 36.83,36.83 36.83,49.02 36.32,49.53 36.07,49.53 35.56,50.04 MD1.JTAG_TDO
TMS  (via drill 0.38, 0.51)
  Top 0.254: v38.2,46.46 38.1,46.46 36.83,47.73 36.83,49.05 36.2,49.68 32.38,49.68 31.75,50.32 31.27,50.8 MD1.JTAG_TMS | 34.29,32.67 IC1.75 34.83,32.67 v35.69,33.53
  Bottom 0.254: v35.69,33.53 36.93,33.53 38.2,34.8 v38.2,46.46
USB_RXD
  Top 0.254: MD1.C04 40.64,46.99 39.85,46.2 39.85,45.44 38.58,44.17 23.15,44.17 22.84,43.85 22.84,41.85 23.15,41.53 25.42,41.53 25.67,41.27 IC1.90
USB_TXD  (via drill 0.38)
  Top 0.254: IC1.86 27.67,40.58 27.99,40.89 44.45,40.89 45.72,39.62 v45.72,39.37
  Bottom 0.254: v45.72,39.37 45.72,46.99 44.45,48.26 MD1.C02
VCCAUX  (via drill 0.38)  (1 unrouted)
  Top 0.254: v20.55,22.35 20.55,22.67 IC1.21 15.85,22.67 15.85,22.49 C1.1 | v31.04,21.57 30.67,21.57 IC1.46 30.67,15.75 31.18,15.24 31.38,15.24 C2.1 | v32.31,32.51 32.31,32.17 IC1.74 36.45,32.17 C3.1 | v23.34,33.05 22.67,33.05 IC1.96 22.67,37.15 C4.1
  Top 0.61: MD1.A05 3.81,45.72 3.81,52.22 15.24,52.22 | 15.24,52.22 43.2,52.22 | MD1.JTAG_REF 43.18,52.22 43.2,52.22 | 43.2,52.22 49.53,52.22 49.53,46.99 MD1.B35 | 15.24,52.22 MD1.C23
  Top 0.813: VCCO_2_3.4 21.59,46.79 26.01,46.79 | v26.01,45.26 26.01,46.79 | 26.01,46.79 30.48,46.79 31.75,45.52 VCCO_0_1.4 | MD1.C23 MD1.C21 | MD1.C22 MD1.C24
  Bottom 0.254: v20.55,22.35 24.38,22.35 24.38,24.38 | v31.04,21.57 31.04,24.18 29.06,24.18 | v32.31,32.51 32.31,27.89 29.06,27.89 | v23.34,33.05 23.34,32.13 26.01,32.13
  Bottom 0.813: MD1.C22 17.78,46.79 21.54,46.79 21.54,45.21 VCCO_2_3.4 | 24.59,28.85 26.01,28.85 26.01,32.13 v26.01,45.26
  pour Bottom (isolate 0.381): 24.13,29.21 29.21,29.21 29.21,24.13 24.13,24.13
VCCINT  (via drill 0.38)
  Top 0.254: IC1.28 C6.1 | 30.68,34.42 IC1.80 30.67,35.75 31.62,36.7 31.62,37.2 C8.1 | IC1.6 15.67,30.17 15.36,30.48 14.87,30.48 C5.1 | IC1.56 37.36,23.17 38.63,21.9 C7.1 | v35.94,42.67 v41.91,42.67
  Bottom 0.406: VCCO_0_1.2 29.21,43.81 35.94,43.81 v35.94,42.67 35.94,43.18 | 31.62,28.96 v31.5,28.96 31.5,29.21
  Bottom 0.61: 31.62,28.96 31.62,30.48 29.46,30.48 29.46,35.31 32.26,35.31 v34.29,37.34 | 32.13,25.4 v32.13,25.78 32.13,20.32 29.21,20.32 29.21,21.59 21.46,21.59 v20.57,20.7
  Bottom 0.813: MD1.C26 12.7,45.21 16.68,45.21 | 16.68,45.21 VCCO_2_3.2 | v35.94,42.67 35.94,37.34 v34.29,37.34 | 16.68,45.21 16.68,40.64 22.1,40.64 22.1,31.29 C5.1 14.87,32.77 v15.11,32.77 | MD1.C27 7.37,50.8 7.37,44.58 v7.09,44.58 | v41.91,42.67 v41.91,45.72
  pour Top (isolate 0.203, rank 2, no thermals): 0,53.34 0,0 53.34,0 53.34,53.34
VCCO_0_1  (via drill 0.38)
  Top 0.254: 30.28,30.07 31.5,31.29 31.5,31.67 IC1.73 37.53,31.67 C12.1 | 23.98,30.28 23.37,30.28 23.37,32.11 22.17,32.11 IC1.97 22.17,36.45 21.4,36.45 20.7,37.15 C10.1 | 30.07,24.59 30.1,24.59 31.37,23.32 31.37,22.67 IC1.55 36.37,22.67 37.01,22.04 C11.1 | 29.67,36.45 IC1.82 | C9.1 29.67,37.22 29.67,36.45 | 29.67,36.45 29.67,31.42 v28.45,31.42
  Top 0.813: 28.45,29.67 v28.45,31.42 | VCCO_0_1.1 VCCO_0_1.3 VCCO_0_1.5
  Bottom 0.813: v28.45,31.42 28.45,36.58 28.45,42.67 VCCO_0_1.1
  pour Top (isolate 0.305): 30.48,30.48 30.48,22.86 22.86,30.48
VCCO_2_3  (via drill 0.38)
  Top 0.254: IC1.45 | C15.1 14.87,29.16 18.92,29.16 | 18.92,29.16 IC1.8 | 15.06,23.06 C16.1 14.87,23.16 IC1.20 | IC1.20 | IC1.45 30.17,21.92 | 30.17,21.92 30.15,21.92 | 30.17,21.92 29.49,21.92 28.25,23.16 | 22.86,23.16 IC1.20 | 22.86,23.16 23.16,23.16 | 18.92,29.16 21.34,29.16 22.25,28.25 23.16,28.25 | C13.1 23.17,11.8 IC1.31 23.17,23.16 22.86,23.16 | IC1.45 30.17,14.42 C14.1
  Top 0.813: 23.16,28.25 23.16,24.38 27.23,24.38 v27.23,28.04 | v27.23,43.13 27.23,43.31 24.13,43.31 VCCO_2_3.5
  Bottom 0.813: VCCO_2_3.1 VCCO_2_3.3 VCCO_2_3.5 | v27.23,28.04 v27.23,43.13
  pour Top (isolate 0.305): 22.86,22.86 29.21,22.86 22.86,29.21

### Text on the board
tPlace: 1.2V | 2.5V | 3.3V | 1.2V | 2.5V | 3.3V | Bank 2/3 | Bank 0/1 | 3/1/2009 | ButterFly Platform | S3E Cocoon | FPGA | BP1002 Rev. 1.0 | www.GadgetFactory.net | Copyright 2009 | Gadget Factory, LLC